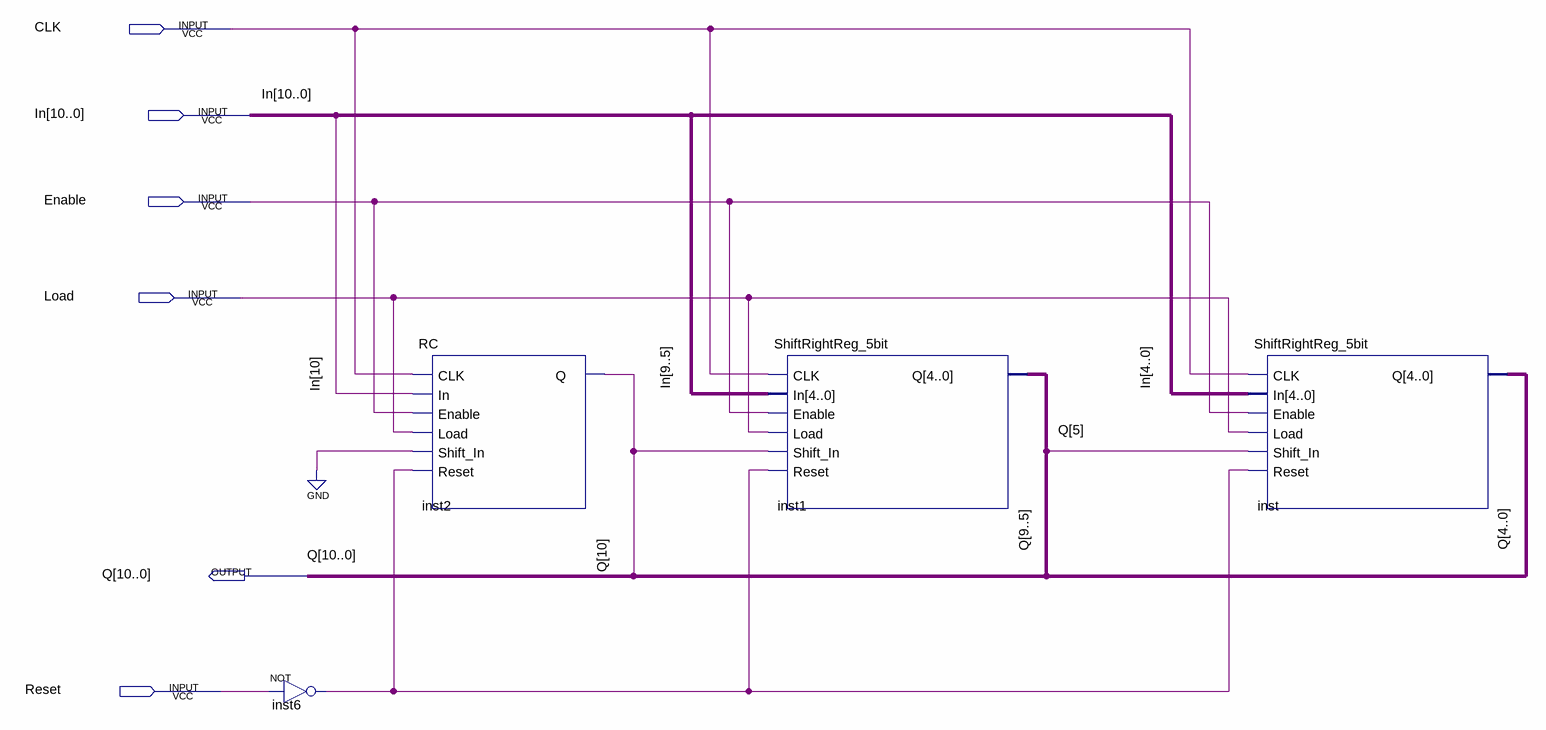
[diagram p0: schematic sheet]
// Quartus schematic ShiftRightReg_11bit.bdf as structural Verilog: 4 symbols, 6 pins
module ShiftRightReg_11bit (
  input  CLK,
  input  [10:0] In,
  input  Enable,
  input  Load,
  input  Reset,
  output [10:0] Q
);

  wire inst6_out;

  not inst6 (inst6_out, Reset);
  RC inst2 (.CLK(CLK), .In(In[10]), .Enable(Enable), .Load(Load), .Shift_In(1'b0), .Reset(inst6_out), .Q(Q[10]));
  ShiftRightReg_5bit inst1 (
    .CLK(CLK), .In(In[9:5]), .Enable(Enable), .Load(Load), .Shift_In(Q[10]), .Reset(inst6_out), .Q(Q[9:5]));
  ShiftRightReg_5bit inst (
    .CLK(CLK), .In(In[4:0]), .Enable(Enable), .Load(Load), .Shift_In(Q[5]), .Reset(inst6_out), .Q(Q[4:0]));
endmodule
